# EasyEDA Pro project ProPrj_esp32s3-ai-chat_audio_2024-08-29_10-47-19_2024-08-29.epro

# Schematic Schematic1
Board Name: Board1; Create Date: 2024-08-29
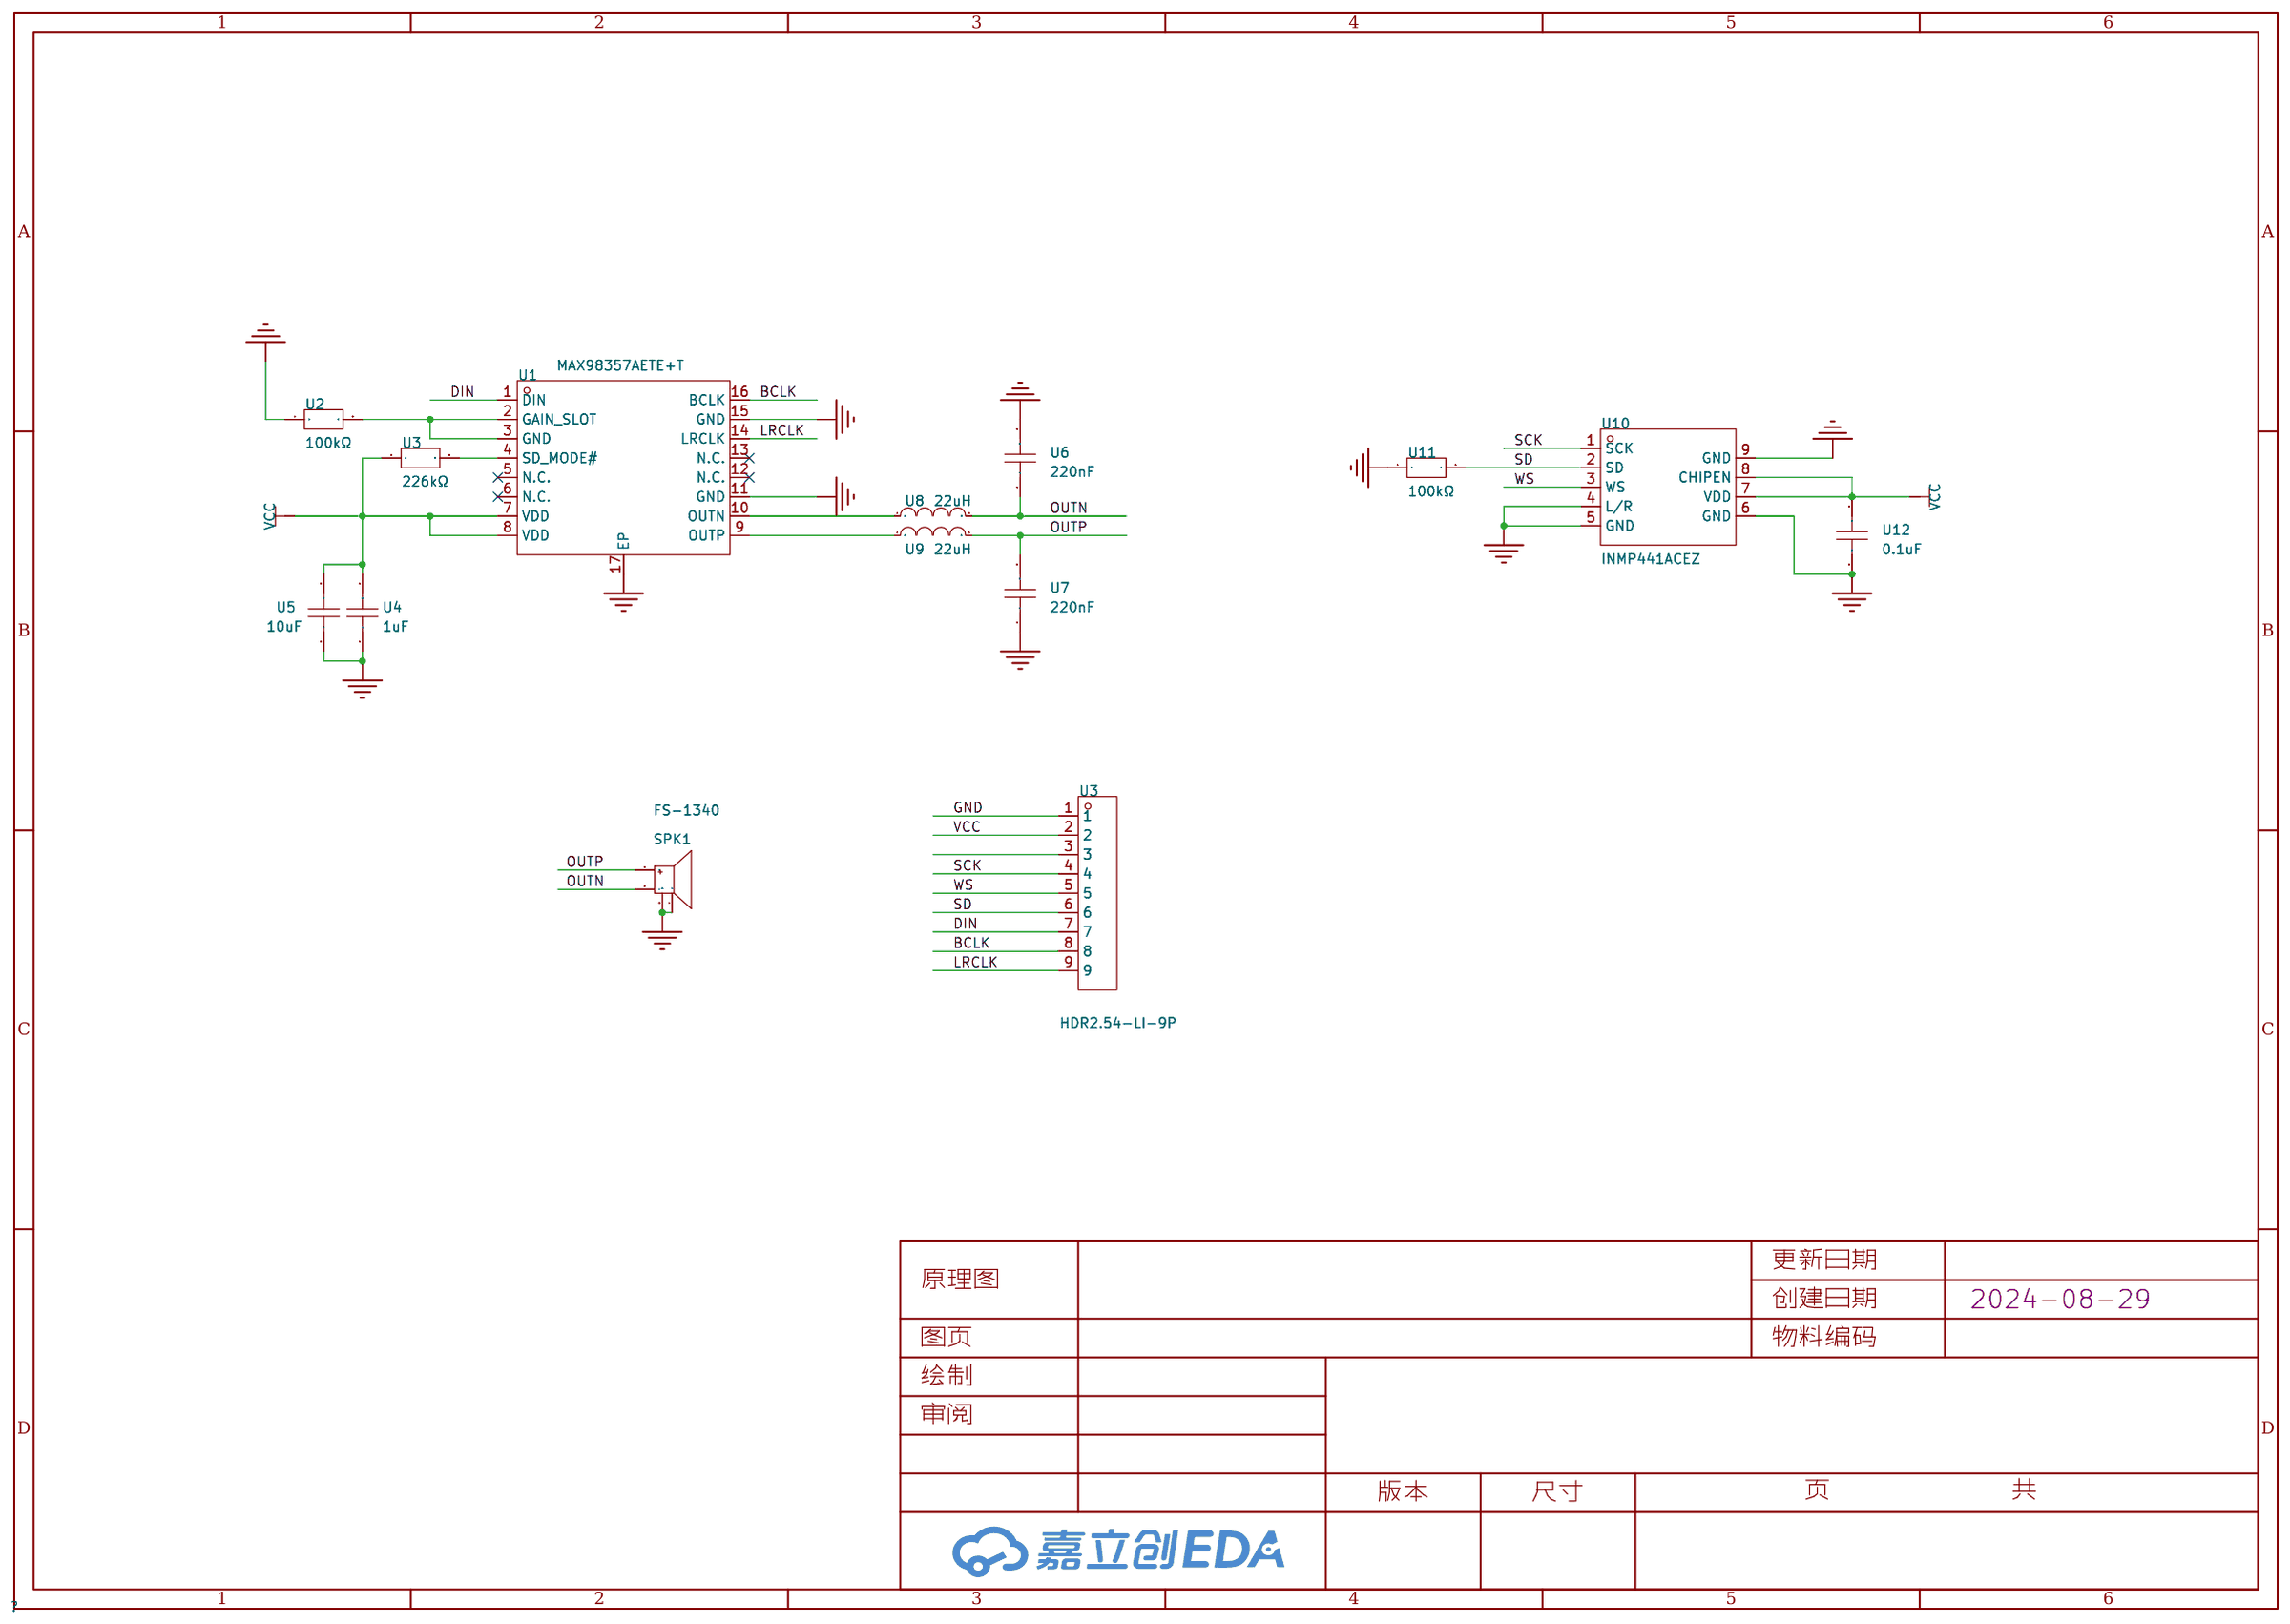
[diagram p0: schematic sheet]

## Parts
SPK1  FS-1340  [BUZ-SMD_4P-L13.0-W13.0-P11.4-BL]
U1  MAX98357AETE+T  [TQFN-16_L3.0-W3.0-P0.50-BL-EP1.5]
U2  100kΩ  [R0603]
U3  226kΩ  [R0603]
U3#2  HDR2.54-LI-9P  [HDR-TH_9P-P2.54-V-M]
U4  1uF  [C0603]
U5  10uF  [C0603]
U6  220nF  [C0603]
U7  220nF  [C0603]
U8  22uH  [L0603]
U9  22uH  [L0603]
U10  INMP441ACEZ  [MID-SMD_L4.7-W3.8_INMP441ACEZ]
U11  100kΩ  [R0603]
U12  0.1uF  [C0603]

## Library data of the parts
SPK1 = FS-1340: LCSC Part Name: 喇叭13*13MM-4.0H 8Ω0.5W 贴片; Supplier Part: C482342; Manufacturer: FUET(福声科技); JLCPCB Part Class: 扩展库; Datasheet: https://atta.szlcsc.com/upload/public/pdf/source/20200113/C482342_9BDDCA56EED20E8AF6A7D6A5F1ED1CC9.pdf; Supplier: LCSC
U1 = MAX98357AETE+T: 功放类型:-;扬声器通道数:单声道;输出功率:3.2Wx2@4Ω;; Supplier Part: C910544; Manufacturer: ADI(亚德诺)/MAXIM(美信); Supplier Footprint: TQFN-16-EP(3x3); JLCPCB Part Class: 扩展库; Datasheet: https://atta.szlcsc.com/upload/public/pdf/source/20210106/C910544_CB6DE4B2CEE254A72E6BDB40E718D281.pdf; Supplier: LCSC; Speaker Channels: 单声道; Output Power: 3.2Wx2@4Ω; Supply Voltage: 2.5V~5.5V; Operating Temperature: -40℃~+85℃
U2 U3 U11 = HQ03W5J0104T5E: 电阻类型:-;阻值:100kΩ;精度:±5%;功率:200mW;最大工作电压:75V;温度系数:±100ppm/℃;; LCSC Part Name: 100kΩ ±5% 200mW; Supplier Part: C2792071; Manufacturer: UNI-ROYAL(厚声); Supplier Footprint: 0603; JLCPCB Part Class: 扩展库; Datasheet: https://atta.szlcsc.com/upload/public/pdf/source/20210330/C2758625_90D19EEA9B8C23AA9BAF71D52BD1DB3E.pdf; Supplier: LCSC; Tolerance: ±5%; Power(Watts): 200mW; Overload Voltage (Max): 75V; Temperature Coefficient: ±100ppm/℃; Operating Temperature Range: -55℃~+155℃
U3#2 = HDR2.54-LI-9P: Supplier Part: C9900020142; JLCPCB Part Class: 扩展库; Supplier: LCSC
U4-U7 U12 = GRT188C81A106ME13J: 容值:10uF;精度:±20%;额定电压:10V;材质(温度系数):X6S;; LCSC Part Name: 10uF ±20% 10V; Supplier Part: C3859070; Manufacturer: muRata(村田); Supplier Footprint: 0603; JLCPCB Part Class: 扩展库; Datasheet: https://atta.szlcsc.com/upload/public/pdf/source/20210818/CBE219D8DE527EBAD6F9BA52C7DC1A42.pdf; Supplier: LCSC; Tolerance: ±20%; Voltage Rated: 10V; Temperature Coefficient: X6S
U8 U9 = MLF1608C220M: 电感值:22uH;精度:±20%;额定电流:2mA;饱和电流(Isat):-;直流电阻(DCR):1.7Ω;; LCSC Part Name: 22uH ±20%; Supplier Part: C3910439; Manufacturer: TDK; Supplier Footprint: 0603; JLCPCB Part Class: 扩展库; Datasheet: https://atta.szlcsc.com/upload/public/pdf/source/20200601/C574026_39E6D4F4CCB543012DB5E9A7AB7C2E6F.pdf; Supplier: LCSC; Tolerance: ±20%; Rated Current: 2mA; DC Resistance (DCR): 1.7Ω; Q @ Freq: 20@1MHz; Frequency - Self Resonant: 18MHz
U10 = INMP441ACEZ: Supplier Part: C9900011556; Supplier Footprint: LGA-9; JLCPCB Part Class: 扩展库; Supplier: LCSC

## Nets
GND: SPK1.3 SPK1.4 U1.11(GND) U1.15(GND) U1.17(EP) U2.1 U3#2.1 U4.1 U5.1 U6.2 U7.1 U10.4(L/R) U10.5(GND) U10.6(GND) U10.9(GND) U11.1 U12.1
VCC: U1.7(VDD) U1.8(VDD) U3.1 U3#2.2 U4.2 U5.2 U10.7(VDD) U10.8(CHIPEN) U12.2
BCLK: U1.16(BCLK) U3#2.8
DIN: U1.1(DIN) U3#2.7
LRCLK: U1.14(LRCLK) U3#2.9
OUTN: SPK1.2(-) U6.1 U8.2
OUTP: SPK1.1(+) U7.2 U9.2
SCK: U3#2.4 U10.1(SCK)
SD: U3#2.6 U10.2(SD) U11.2
WS: U3#2.5 U10.3(WS)
Net-(U1-2): U1.2(GAIN_SLOT) U1.3(GND) U2.2
Net-(U1-4): U1.4(SD_MODE#) U3.2
Net-(U1-9): U1.9(OUTP) U9.1
Net-(U1-10): U1.10(OUTN) U8.1

Not connected (* = marked no-connect by the designer): U1 5(N.C.)* 6(N.C.)* 12(N.C.)* 13(N.C.)*; U3#2 3

# Board PCB1
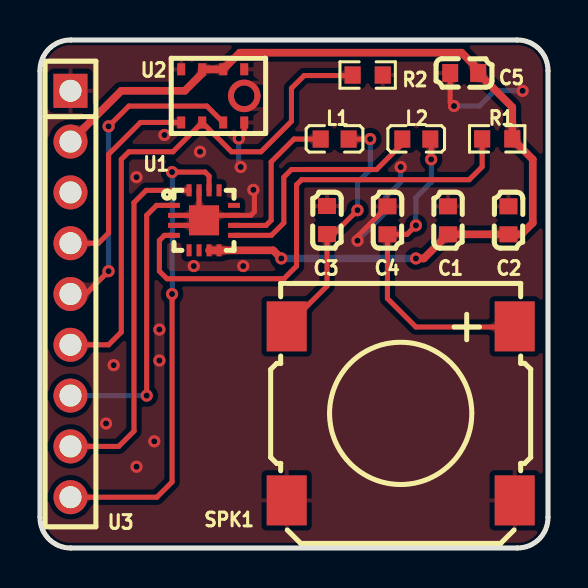
[diagram p1: board, top side]
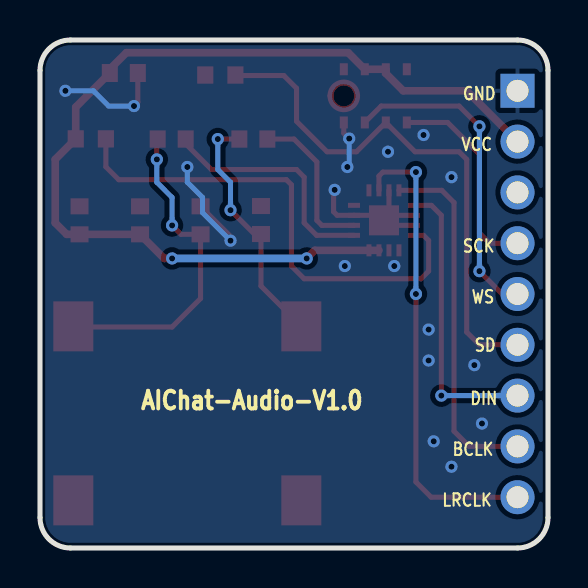
[diagram p2: board, bottom side, seen from below]

Outline 25.4 x 25.4 mm; copper layers: Top Layer, Bottom Layer. Coordinates in mm from the lower left corner of the outline.
Outline path: 0,23.88 0,1.52 arc(0.45,0.45) 1.52,0 23.88,0 arc(24.95,0.45) 25.4,1.52 25.4,23.88 arc(24.95,24.95) 23.88,25.4 1.52,25.4 arc(0.45,24.95) 0,23.88
Stack: Top Layer 0.035mm / Dielectric1 1.51mm FR4 er 4.5 / Bottom Layer 0.035mm

## Design rules (mm)
template: JLCPCB Capability(Two Layers Board)
spacing copperThickness1oz (default): track to track 0.102, other pairs 0.152 to 0.3
spacing copperThickness2oz: track to track 0.203, other pairs 0.152 to 0.3
track width copperThickness1oz (default): min 0.127, default 0.254, max 2.54
track width copperThickness2oz: min 0.203, default 0.254, max 2.54
differential pair differentialPair (default): width min 0.127, default 0.254, max 2.54; gap min 0.152, default 0.152
via viaSize (default): diameter min 0.5, default 0.61, max 10; hole min 0.3, default 0.305, max 6.3

## Placement (name value [footprint] x y rotation side)
C1  10uF  [C0603]  20.4 16.38 270 top
C2  1uF  [C0603]  23.42 16.38 270 top
C3  220nF  [C0603]  14.35 16.4 90 top
C4  220nF  [C0603]  17.37 16.38 270 top
C5  0.1uF  [C0603]  21.21 23.75 0 top
L1  22uH  [L0603]  14.73 20.45 0 top
L2  22uH  [L0603]  18.82 20.45 0 top
R1  226kΩ  [R0603]  22.86 20.46 180 top
R2  100kΩ  [R0603]  16.38 23.65 180 top
SPK1  FS-1340  [BUZ-SMD_4P-L13.0-W13.0-P11.4-BL]  18.03 6.73 180 top
U1  MAX98357AETE+T  [TQFN-16_L3.0-W3.0-P0.50-BL-EP1.5]  8.2 16.38 270 top
U2  100kΩ  [MID-SMD_L4.7-W3.8_INMP441ACEZ]  8.64 22.61 0 top
U3  226kΩ  [HDR-TH_9P-P2.54-V-M]  1.52 12.7 270 top

## Footprints (pads in the part's own frame, mm; a bottom-side part is the same pattern mirrored in y, then rotated)
BUZ-SMD_4P-L13.0-W13.0-P11.4-BL
  rect 2x2.5 smd: 1(-5.7,-4.35) 2(5.7,-4.35) 3(5.7,4.35) 4(-5.7,4.35)
C0603
  rect 0.8x0.9 smd: 1(-0.7,0) 2(0.7,0)
HDR-TH_9P-P2.54-V-M
  rect 1.7x1.7 hole 1.1: 1(-10.16,0)
  round 1.7 hole 1.1: 2(-7.62,0) 3(-5.08,0) 4(-2.54,0) 5(0,0) 6(2.54,0) 7(5.08,0) 8(7.62,0) 9(10.16,0)
L0603
  rect 0.8x0.864 smd: 1(-0.7,0) 2(0.7,0)
MID-SMD_L4.7-W3.8_INMP441ACEZ
  rect 0.4x0.6 smd: 1(-1.575,-1.33) 2(-0.525,-1.33) 3(0.525,-1.33) 4(1.575,-1.33) 6(1.575,1.33) 7(0.525,1.33) 8(-0.525,1.33) 9(-1.575,1.33)
  custom 1.626x0.963 smd: 5(1.575,0.664)
  custom 1.626x0.966 smd: 5(1.575,-0.661)
R0603
  rect 0.806x0.864 smd: 1(-0.753,0) 2(0.753,0)
TQFN-16_L3.0-W3.0-P0.50-BL-EP1.5
  rect 0.25x0.6 smd: 1(-0.749,-1.5) 2(-0.248,-1.5) 3(0.252,-1.5) 4(0.751,-1.5) 9(0.75,1.5) 10(0.25,1.5) 11(-0.25,1.5) 12(-0.749,1.5)
  rect 0.6x0.25 smd: 5(1.5,-0.748) 6(1.5,-0.248) 7(1.5,0.252) 8(1.5,0.752) 13(-1.5,0.752) 14(-1.5,0.252) 15(-1.5,-0.248) 16(-1.5,-0.748)
  rect 1.5x1.5 smd: 17(0,0)

## Nets
GND: C1.1 C2.1 C3.2 C4.1 C5.1 R2.1 SPK1.3 SPK1.4 U1.2 U1.3 U1.11 U1.15 U1.17 U2.4 U2.5 U2.6 U2.9 U3.1
VCC: C1.2 C2.2 C5.2 R1.1 U1.7 U1.8 U2.7 U2.8 U3.2
BCLK: U1.16 U3.8
DIN: U1.1 U3.7
LRCLK: U1.14 U3.9
OUTN: C3.1 L1.2 SPK1.2
OUTP: C4.2 L2.2 SPK1.1
SCK: U2.1 U3.4
SD: R2.2 U2.2 U3.6
WS: U2.3 U3.5
$1N644: L1.1 U1.10
$1N646: L2.1 U1.9
$1N654: R1.2 U1.4
$1N2098: U3.3

Pads without a net: U1 5 6 12 13

## Via types
v1: diameter 0.61, hole 0.305, Top Layer to Bottom Layer, 29 vias

## Routing (per net, layer and track width the routed paths; a pad name or vN(x,y) marks a point on that pad's centre or on a via; arc(x,y) is an arc through that point)
GND: length 22.7
  Top Layer w0.254: v1(20.7,22.1) 20.51,22.29 C5.1 ; v1(15.88,15.37) 15.88,15.59 C4.1 ; v1(10.67,17.91) 10.72,17.85 10.72,16.81 10.54,16.63 U1.11 8.45,16.63 U1.17 7.95,16.13 U1.3 ; v1(9.94,20.47) 10.21,20.74 10.21,21.28 ; U1.2 7.95,16.63 U1.15
  Bottom Layer w0.254: v1(15.88,15.37) 17.27,16.76 17.27,17.53 18.03,18.29 v1(18.03,19.05) ; v1(9.94,20.47) 9.94,19.14 v1(10.03,19.05) ; v1(20.7,22.1) 21.97,22.1 22.73,22.86 v1(24.13,22.86)
  vias: v1(3.3,6.22) v1(3.68,9.14) v1(4.83,18.54) v1(4.83,4.06) v1(5.72,5.33) v1(5.97,10.92) v1(5.97,9.37) v1(6.22,20.65) v1(7.69,14.1) v1(8,19.81) v1(10.16,14.1)
VCC: length 48.6
  Top Layer w0.381: U1.7 U1.8 11.66,14.88 v1(12.06,14.48) ; U3.2 4.06,22.86 7.24,22.86 8.11,23.73 U2.8 U2.7 9.99,24.77 21.08,24.77 21.91,23.94 C5.2 23.61,22.04 R1.1 24.64,19.43 24.64,16.26 24.06,15.68 C2.2 C1.2 19.19,14.48 v1(18.8,14.48)
  Bottom Layer w0.381: v1(12.06,14.48) v1(18.8,14.48)
BCLK: length 17.9
  Top Layer w0.254: U1.16 5.31,17.88 4.7,17.27 4.7,5.84 3.94,5.08 U3.8
DIN: length 14.4
  Top Layer w0.254: U1.1 5.83,17.13 5.33,16.64 v1(5.33,7.62)
  Bottom Layer w0.254: v1(5.33,7.62) U3.7
LRCLK: length 23.5
  Top Layer w0.254: v1(6.6,18.8) 8.25,18.8 8.45,18.6 U1.14 ; U3.9 5.84,2.54 6.6,3.3 v1(6.6,12.7)
  Bottom Layer w0.254: v1(6.6,18.8) v1(6.6,12.7)
OUTN: length 12.4
  Top Layer w0.254: SPK1.2 14.35,13.1 C3.1 14.68,15.7 v1(15.88,16.89) ; L1.2 v1(16.51,20.45)
  Bottom Layer w0.254: v1(15.88,16.89) 15.88,18.29 16.51,18.92 v1(16.51,20.45)
OUTP: length 16.4
  Top Layer w0.254: SPK1.1 23.7,11.05 18.8,11.05 17.37,12.47 C4.2 18.35,15.68 v1(18.8,16.13) ; v1(19.56,19.43) 19.56,20.4 L2.2
  Bottom Layer w0.254: v1(19.56,19.43) 19.56,18.29 18.8,17.53 v1(18.8,16.13)
SCK: length 10.3
  Top Layer w0.254: U2.1 5.02,21.28 3.43,19.69 3.43,15.75 2.92,15.24 U3.4
SD: length 26.9
  Top Layer w0.254: U3.6 3.43,10.16 4.06,10.8 4.06,19.43 4.44,19.81 6.65,19.81 U2.2 9.57,19.81 11.05,19.81 12.57,21.34 12.57,22.99 13.21,23.62 15.6,23.62 R2.2
WS: length 16.1
  Top Layer w0.254: v1(3.43,21.08) 4.44,22.1 8.34,22.1 U2.3 ; U3.5 2.29,12.7 v1(3.43,13.84)
  Bottom Layer w0.254: v1(3.43,21.08) v1(3.43,13.84)
$1N644: length 7.8
  Top Layer w0.254: L1.1 12.7,20.45 11.56,19.3 11.56,16.38 11.3,16.13 9.7,16.13 U1.10
$1N646: length 11.9
  Top Layer w0.254: U1.9 11.57,15.63 12.19,16.26 12.19,18.54 12.57,18.92 16.83,18.92 18.12,20.21 L2.1
$1N654: length 24.8
  Top Layer w0.254: R1.2 22.11,19.06 21.46,18.42 13.08,18.42 12.83,18.16 12.83,14.1 12.19,13.46 6.35,13.46 5.97,13.84 5.97,15.38 6.22,15.63 U1.4

## Copper pours and planes (outline as drawn; the poured copper is in the pictures)
GND on Top Layer: -0.13,25.65 25.53,25.65 25.53,-0.51 -0.13,-0.51
GND on Bottom Layer: -0.51,25.91 26.54,25.91 26.54,-0.76 -0.51,-0.76

Small or netless copper shapes (teardrops, artwork), in the pictures only: 57 on Top Layer, 18 on Bottom Layer

## Text on the board
Bottom Silkscreen Layer: SD | WS | DIN | GND | SCK | VCC | BCLK | LRCLK | AIChat-Audio-V1.0
